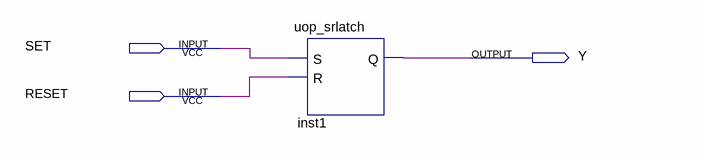
[diagram p0: schematic sheet]
// Quartus schematic behavioural.bdf as structural Verilog: 1 symbols, 3 pins
module behavioural (
  input  SET,
  input  RESET,
  output Y
);

  uop_srlatch inst1 (.S(SET), .R(RESET), .Q(Y));
endmodule
